# EasyEDA Pro project CALU_BMS_1_2_0_0.epro, schematic Master BMS

## Sheets
1 MAIN: Board Name: Master; Create Date: 2025-09-05; Page Name: MAIN; Project Name: CALU_BMS; Schematic Name: Master BMS; Update Date: 2025-10-01; Company: EasyEDA.com; Page Size: A4; Version: V1.0.0.1
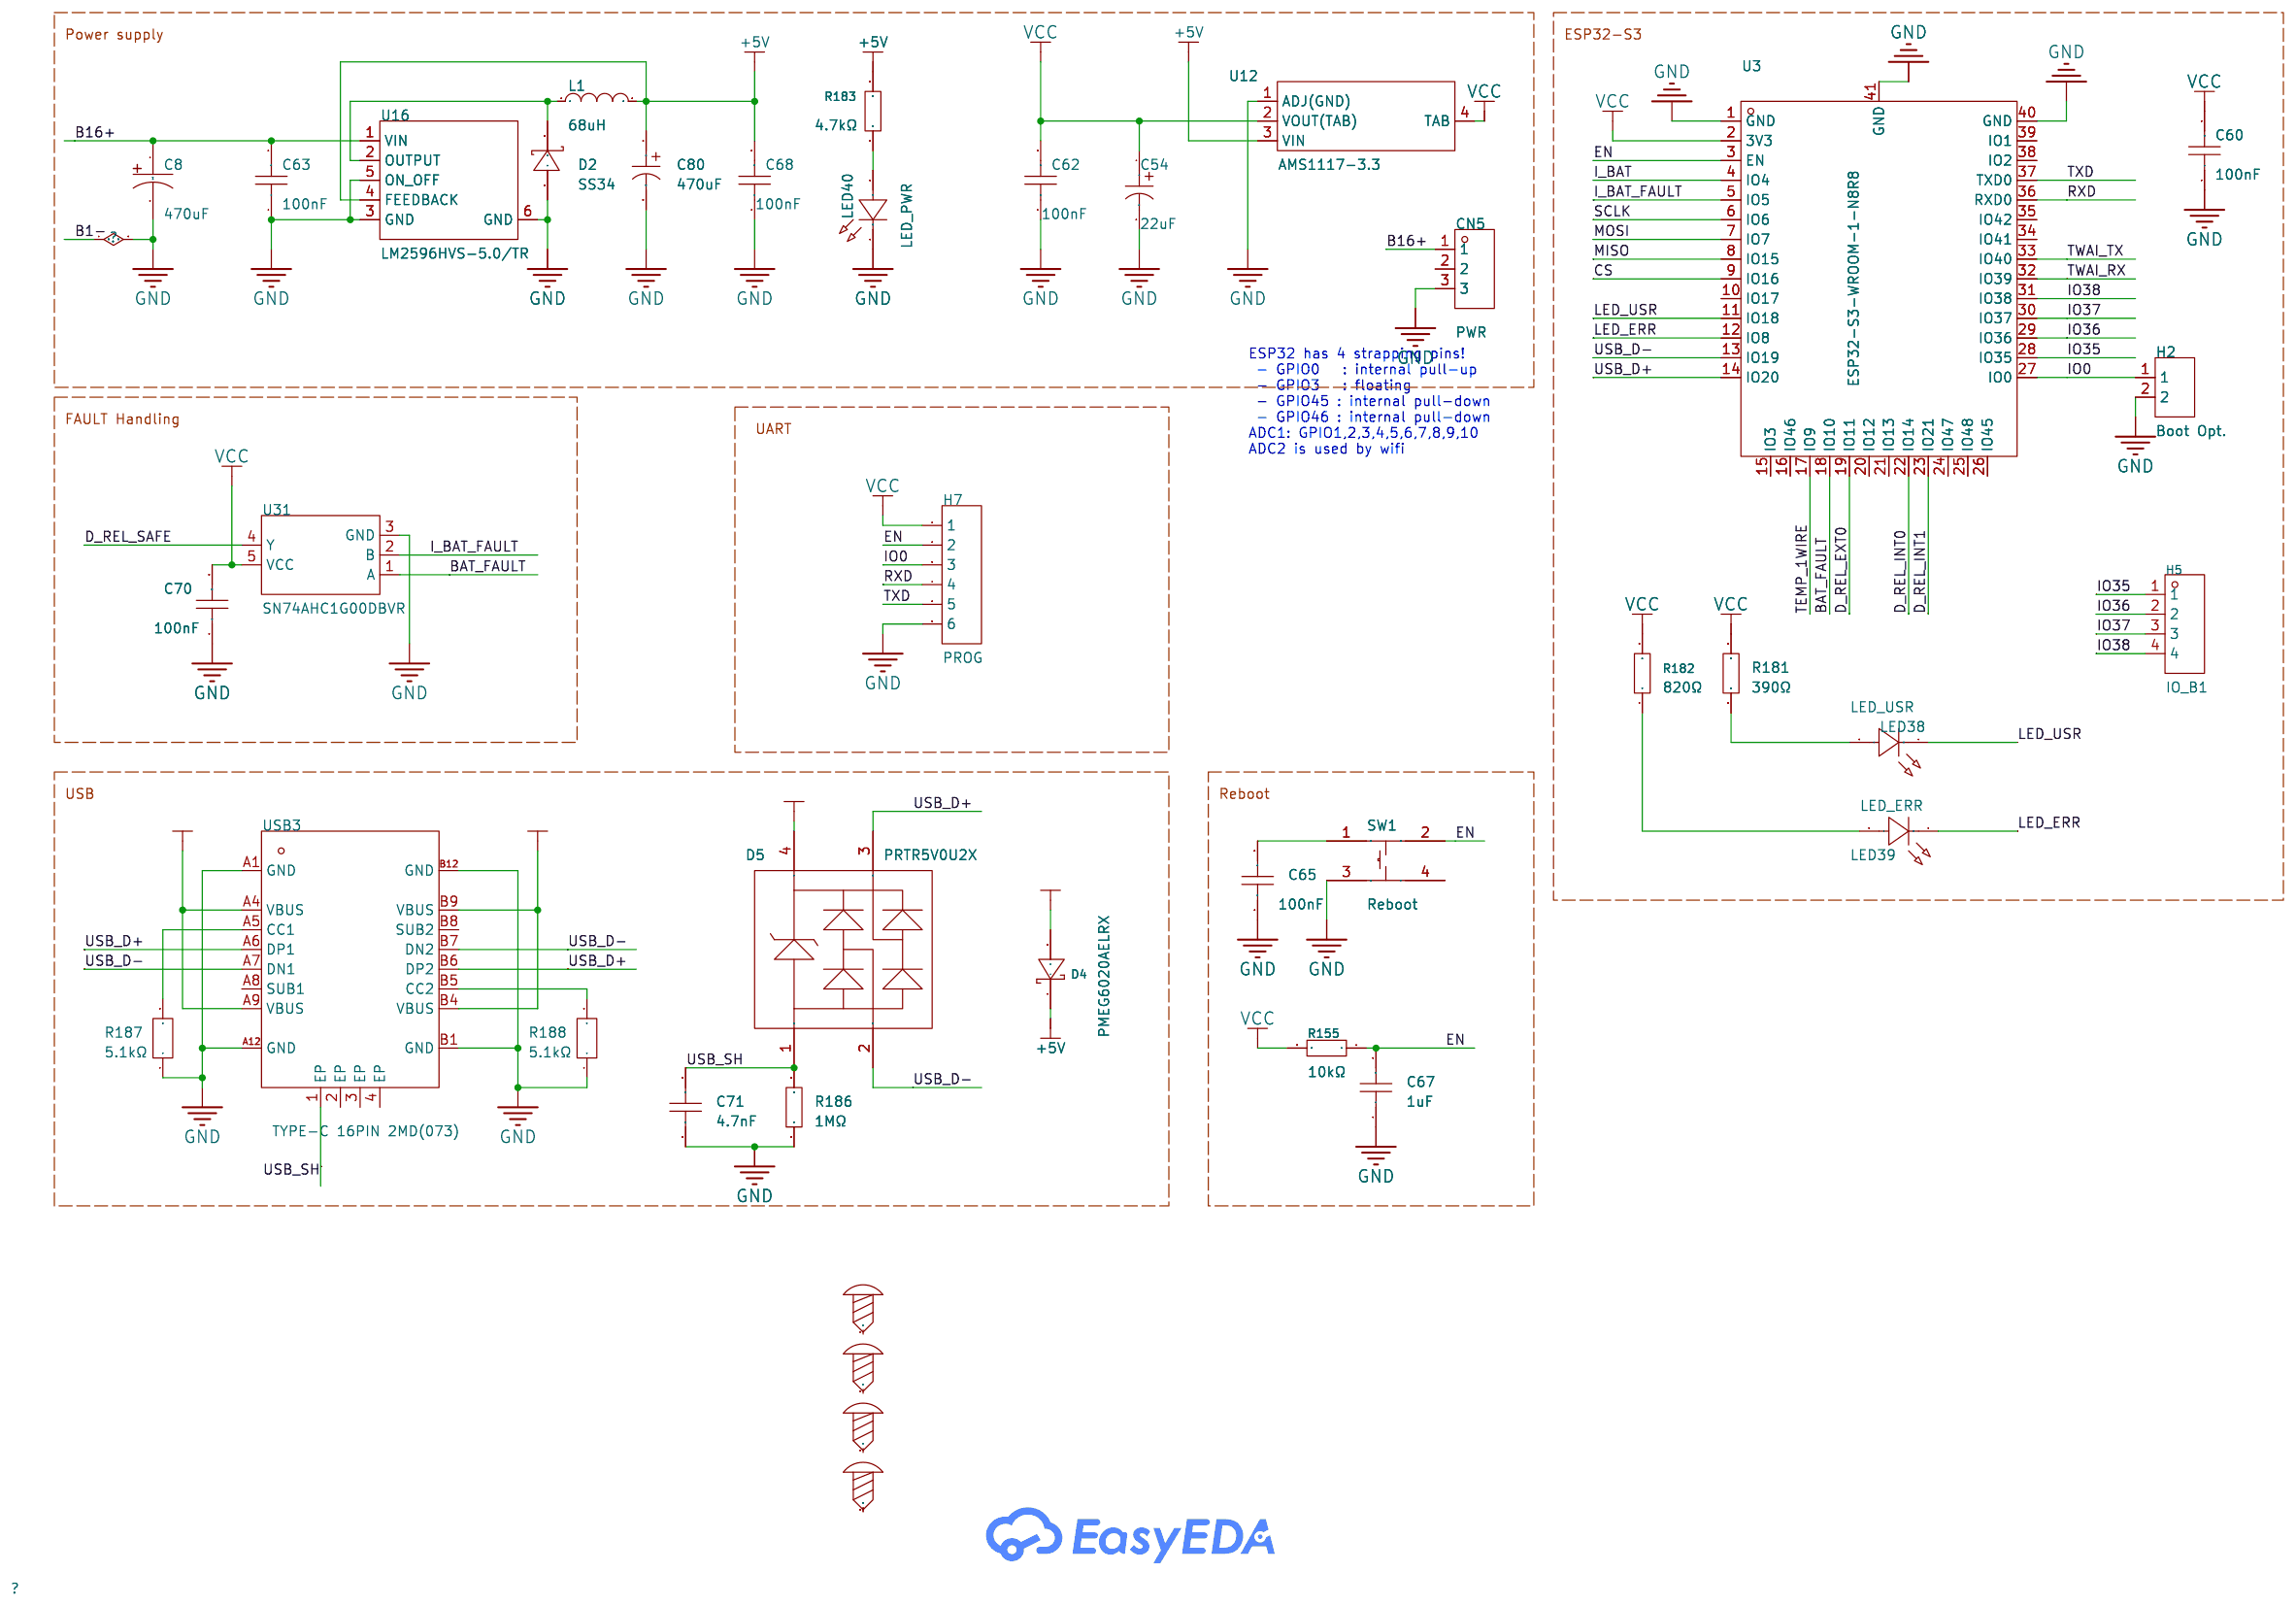
[diagram p6: MAIN]
2 CAN: Create Date: 2025-09-10; Page Name: CAN; Update Date: 2025-09-18; Version: V1.0
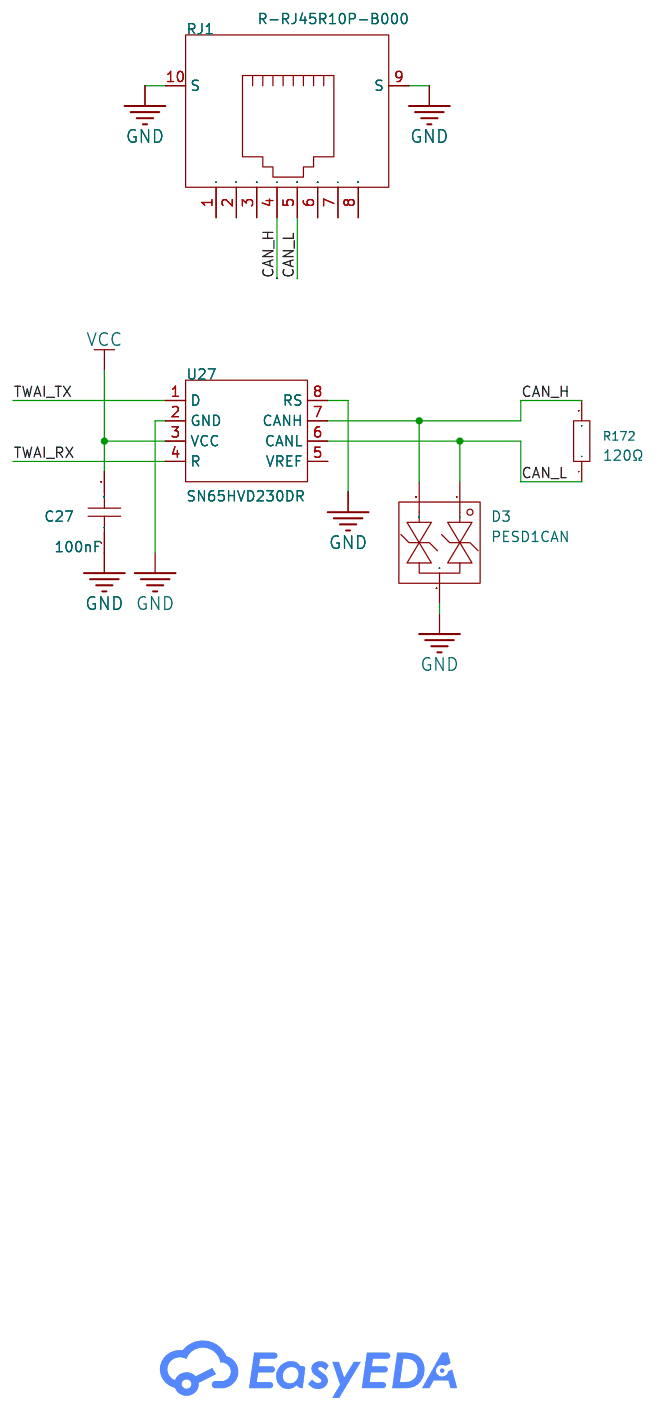
[diagram p7: CAN]
3 RELAY: Create Date: 2025-09-10; Page Name: RELAY; Update Date: 2025-09-18; Version: V1.0
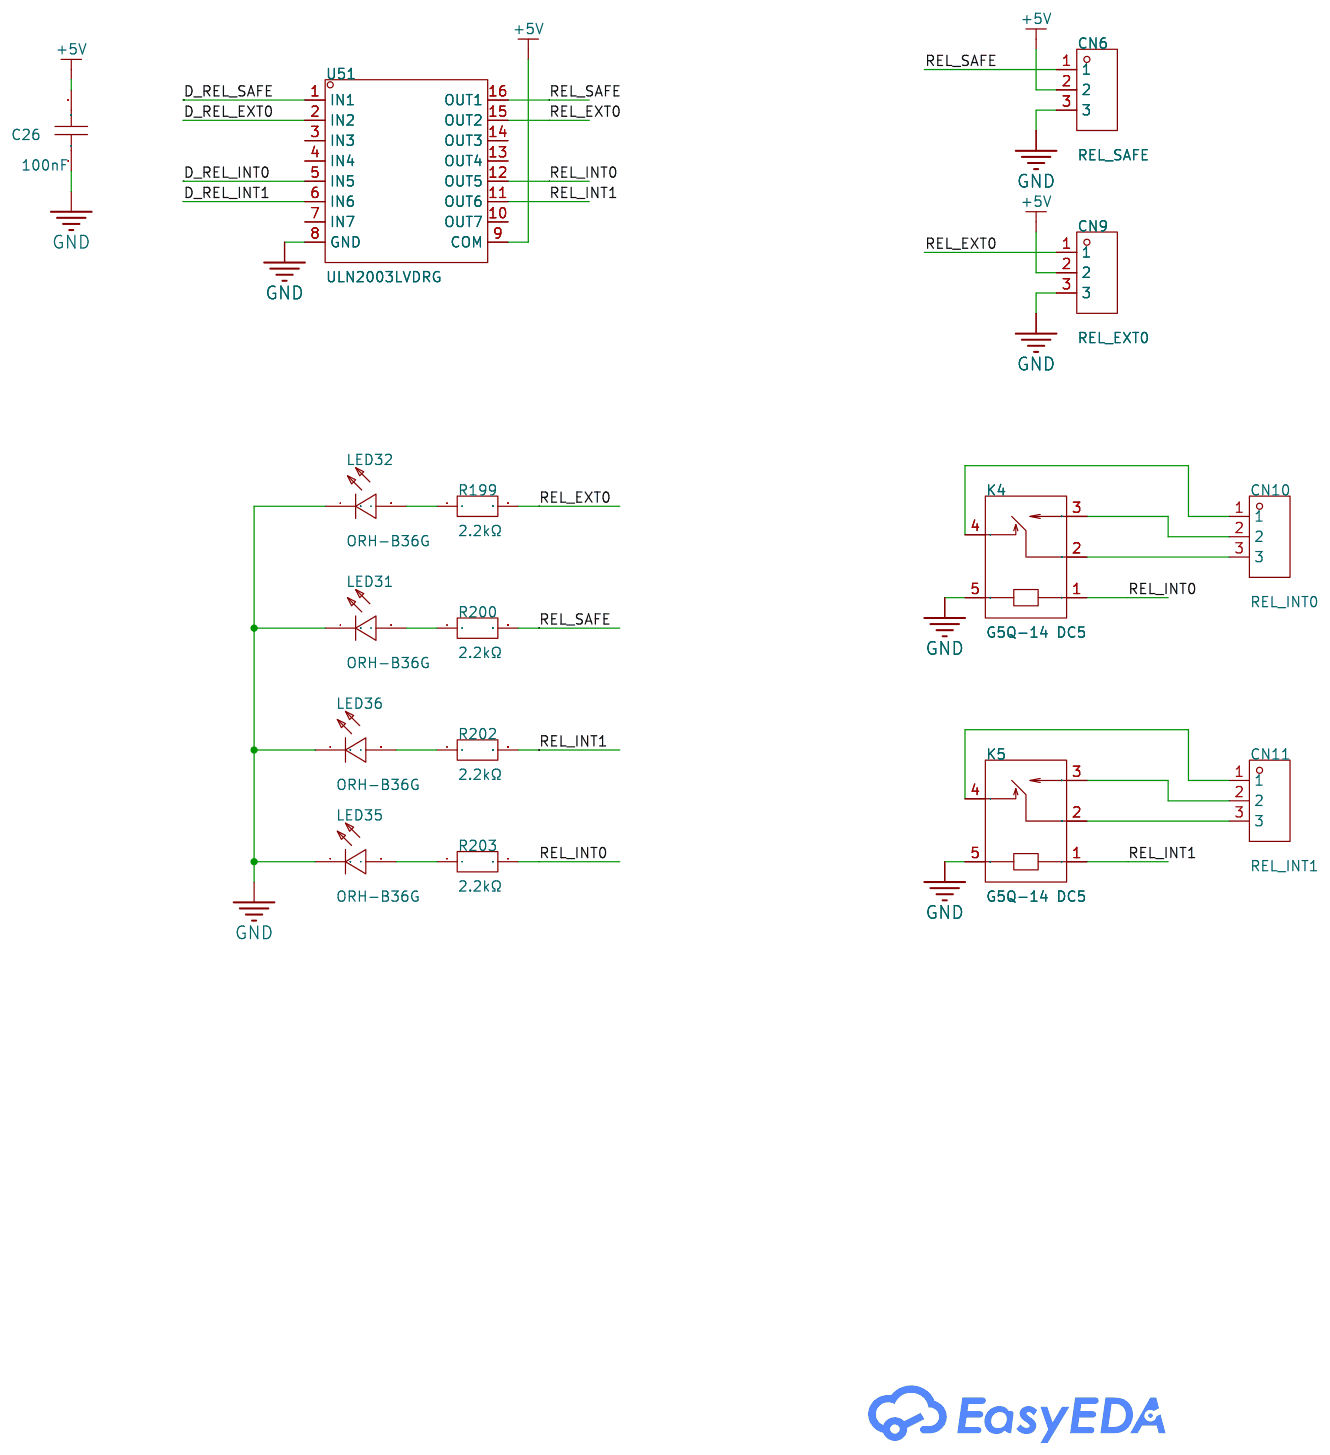
[diagram p8: RELAY]
4 POWER: Create Date: 2025-09-18; Page Name: POWER; Update Date: 2025-09-18; Version: V1.0
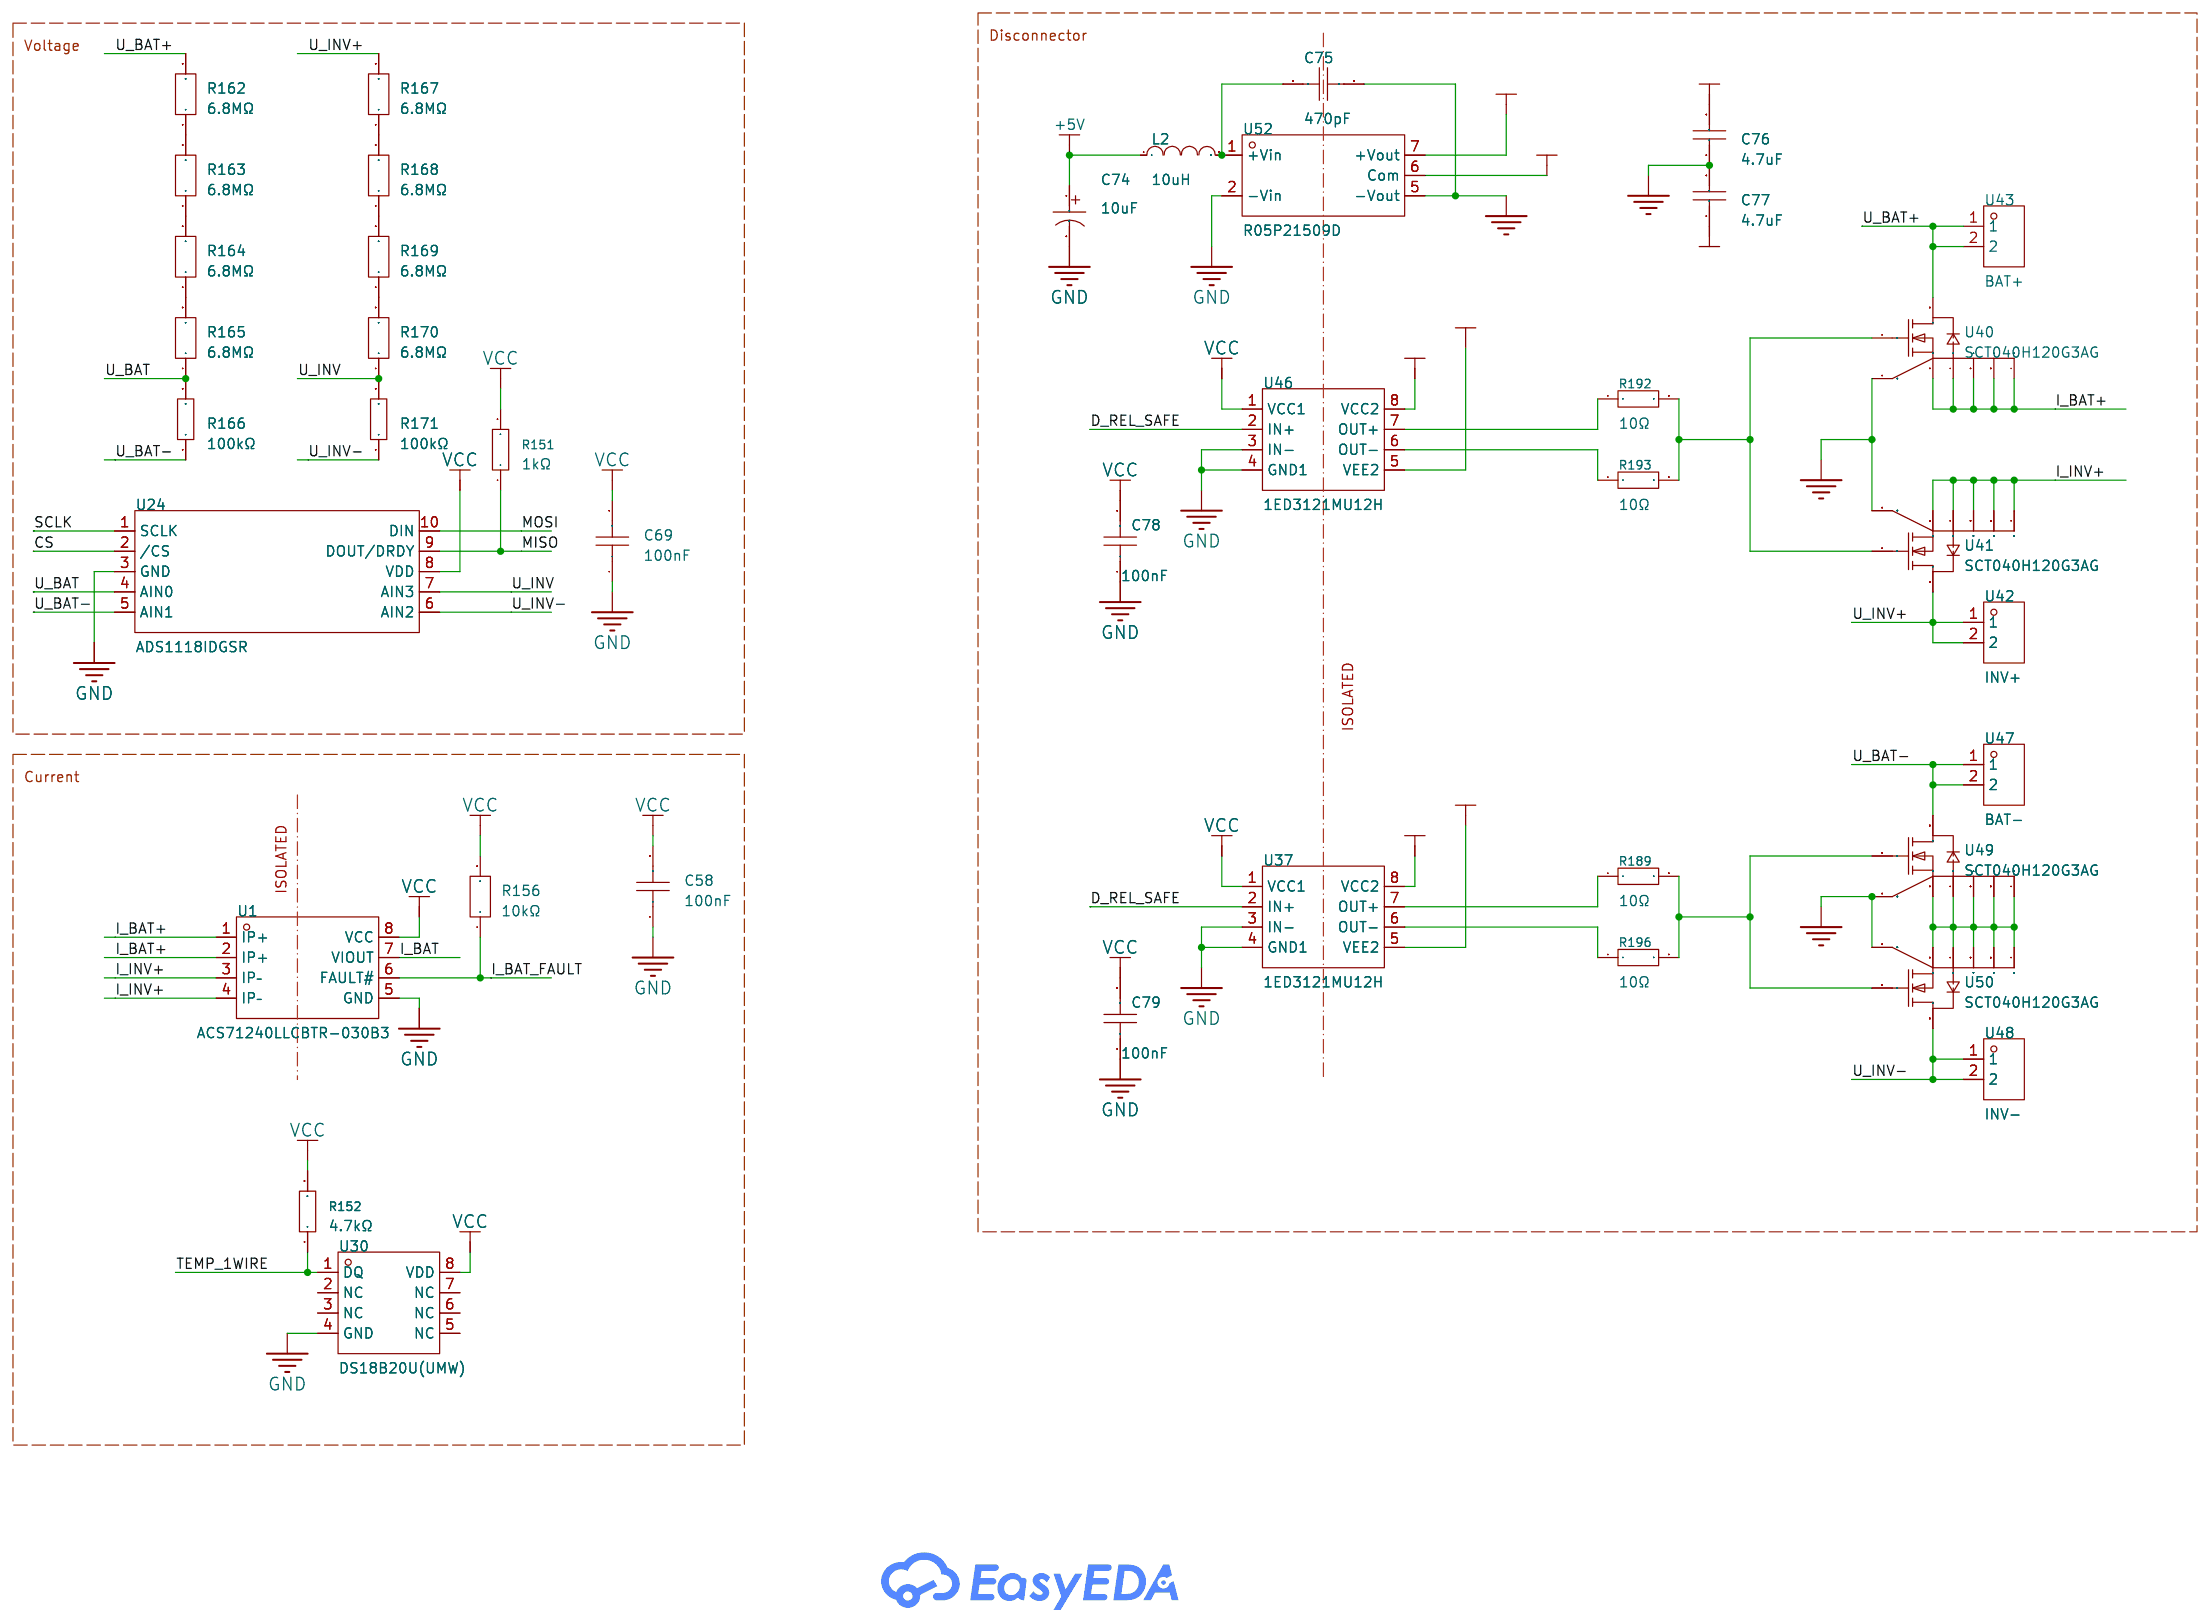
[diagram p9: POWER]

## Parts
sheet CAN
C27  100nF  [C0603]
D3  PESD1CAN  [SOT-23-3_L2.9-W1.3-P1.90-LS2.4-BR]
R172  120Ω  [R0603]
RJ1  R-RJ45R10P-B000  [RJ45-TH_R-RJ45R10P-B000]
U27  SN65HVD230DR  [SOIC-8_L4.9-W3.9-P1.27-LS6.0-BL]
sheet MAIN
C8  470uF  [CAP-SMD_BD16.0-L17.0-W17.0-FD-LS18.0]
C54  22uF  [CAP-SMD_BD5.0-L5.3-W5.3-LS6.0-FD]
C60  100nF  [C0603]
C62  100nF  [C0603]
C63  100nF  [C0603]
C65  100nF  [C0603]
C67  1uF  [C0603]
C68  100nF  [C0603]
C70  100nF  [C0603]
C71  4.7nF  [C0603]
C80  470uF  [CAP-SMD_BD6.3-L6.6-W6.6-LS7.6-RD]
CN5  PWR  [CONN-TH_3P-P3.50_MAX_MX15EDGRM-3.5-GN01-03P-CU-A]
D2  SS34  [SMA_L4.3-W2.6-LS5.2-RD]
D4  PMEG6020AELRX  [SOD-123_L2.6-W1.7-LS3.5-RD]
D5  PRTR5V0U2X  [SOT-143_L2.9-W1.3-P1.92-LS2.3-BL]
H2  Boot Opt.  [HDR-TH_2P-P2.54-V-M]
H5  IO_B1  [HDR-TH_4P-P2.54-V-M]
H7  PROG  [HDR-TH_6P-P2.54-V-M-1]
L1  68uH  [IND-SMD_L12.5-W12.5]
LED38  LED_USR  [LED0603-RD-YELLOW]
LED39  LED_ERR  [LED0603-RD_RED]
LED40  LED_PWR  [LED0603-RD-YELLOW]
R155  10kΩ  [R0603]
R181  390Ω  [R0603]
R182  820Ω  [R0603]
R183  4.7kΩ  [R0603]
R186  1MΩ  [R0603]
R187  5.1kΩ  [R0603]
R188  5.1kΩ  [R0603]
SCREW1  -  [Screw-Hole-M4]
SCREW2  -  [Screw-Hole-M4]
SCREW3  -  [Screw-Hole-M4]
SCREW4  -  [Screw-Hole-M4]
SW1  Reboot  [SW-SMD_4P-L6.0-W6.0-P4.50-LS9.0-H2.5]
U3  ESP32-S3-WROOM-1-N8R8  [WIRELM-SMD_ESP32-S3-WROOM-1]
U12  AMS1117-3.3  [SOT-223-4_L6.5-W3.5-P2.30-LS7.0-BR]
U16  LM2596HVS-5.0/TR  [TO-263-5_L10.2-W8.9-P1.70-LS15.2-BR]
U31  SN74AHC1G00DBVR  [SOT-23-5_L3.0-W1.7-P0.95-LS2.8-BR]
USB3  TYPE-C 16PIN 2MD(073)  [USB-C-SMD_KH-TYPE-C-16P]
sheet POWER
C58  100nF  [C0603]
C69  100nF  [C0603]
C74  10uF  [CAP-SMD_BD4.0-L4.3-W4.3-FD]
C75  470pF  [C1210]
C76  4.7uF  [C1206]
C77  4.7uF  [C1206]
C78  100nF  [C0603]
C79  100nF  [C0603]
L2  10uH  [L0603]
R151  1kΩ  [R0603]
R152  4.7kΩ  [R0603]
R156  10kΩ  [R0603]
R162  6.8MΩ  [R1206]
R163  6.8MΩ  [R1206]
R164  6.8MΩ  [R1206]
R165  6.8MΩ  [R1206]
R166  100kΩ  [R1206]
R167  6.8MΩ  [R1206]
R168  6.8MΩ  [R1206]
R169  6.8MΩ  [R1206]
R170  6.8MΩ  [R1206]
R171  100kΩ  [R1206]
R189  10Ω  [R0603]
R192  10Ω  [R0603]
R193  10Ω  [R0603]
R196  10Ω  [R0603]
U1  ACS71240LLCBTR-030B3  [SOIC-8_L4.9-W3.9-P1.27-LS6.0-BL]
U24  ADS1118IDGSR  [VSSOP-10_L3.0-W3.0-P0.50-LS4.9-BL]
U30  DS18B20U(UMW)  [MSOP-8_L3.0-W3.0-P0.65-LS4.9-BL]
U37  1ED3121MU12H  [PG-DSO-8_L7.5-W6.4-P1.27-LS10.3-BL]
U40  SCT040H120G3AG  [H2PAK-7_L10.4-W10.0-P1.27-LS15.0-BL]
U41  SCT040H120G3AG  [H2PAK-7_L10.4-W10.0-P1.27-LS15.0-BL]
U42  INV+  [CONN-TH_JILN_JL136HT-101601G01]
U43  BAT+  [CONN-TH_JILN_JL136HT-101601G01]
U46  1ED3121MU12H  [PG-DSO-8_L7.5-W6.4-P1.27-LS10.3-BL]
U47  BAT-  [CONN-TH_JILN_JL136HT-101601G01]
U48  INV-  [CONN-TH_JILN_JL136HT-101601G01]
U49  SCT040H120G3AG  [H2PAK-7_L10.4-W10.0-P1.27-LS15.0-BL]
U50  SCT040H120G3AG  [H2PAK-7_L10.4-W10.0-P1.27-LS15.0-BL]
U52  R05P21509D  [PWRM-TH_5P-L19.5-W9.8_YLPTEC_RXXP2XX]
sheet RELAY
C26  100nF  [C0603]
CN6  REL_SAFE  [CONN-TH_3P-P3.50_MAX_MX15EDGRM-3.5-GN01-03P-CU-A]
CN9  REL_EXT0  [CONN-TH_3P-P3.50_MAX_MX15EDGRM-3.5-GN01-03P-CU-A]
CN10  REL_INT0  [CONN-TH_3P-P3.50_MAX_MX15EDGRM-3.5-GN01-03P-CU-A]
CN11  REL_INT1  [CONN-TH_3P-P3.50_MAX_MX15EDGRM-3.5-GN01-03P-CU-A]
K4  G5Q-14 DC5  [RELAY-TH_G5Q-14-DCXX]
K5  G5Q-14 DC5  [RELAY-TH_G5Q-14-DCXX]
LED31  ORH-B36G  [LED0603-RD]
LED32  ORH-B36G  [LED0603-RD]
LED35  ORH-B36G  [LED0603-RD]
LED36  ORH-B36G  [LED0603-RD]
R199  2.2kΩ  [R0603]
R200  2.2kΩ  [R0603]
R202  2.2kΩ  [R0603]
R203  2.2kΩ  [R0603]
U51  ULN2003LVDRG  [SOIC-16_L9.9-W3.9-P1.27-LS6.0-BL]

## Library data of the parts
C26 C27 C58 C60 C62 C63 C65 C68-C70 C78 C79 = CC0603KRX7R9BB104: Capacitance:100nF Tolerance:±10% Tolerance:±10% Voltage Rating:50V Temperature Coefficient:X7R; LCSC Part Name: 100nF ±10% 50V; Supplier Part: C14663; Manufacturer: YAGEO(国巨); Supplier Footprint: 0603; JLCPCB Part Class: Basic Part; Datasheet: https://item.szlcsc.com/datasheet/CC0603KRX7R9BB104/15331.html; Supplier: LCSC; Tolerance: ±10%; Voltage Rating: 50V; Temperature Coefficient: X7R
D3 = PESD1CAN_C20606828: Polarity:Bidirectional Reverse Stand-Off Voltage (Vrwm):24V Clamping Voltage:60V Peak Pulse Current (Ipp):3A@8/20us Peak Pulse Power Dissipation (Ppp):200W@8/20us Voltage - Breakdown:33V Reverse Leakage Current (Ir):1uA level of protection:IEC 61000-4-2 T; Supplier Part: C20606828; Manufacturer: JSMSEMI(杰盛微); Supplier Footprint: SOT-23; JLCPCB Part Class: Extended Part; Datasheet: https://item.szlcsc.com/datasheet/PESD1CAN/21950080.html; Supplier: LCSC; Polarity: Bidirectional; Reverse Stand-Off Voltage (Vrwm): 24V; Clamping Voltage: 60V; Peak Pulse Current (Ipp): 3A@8/20us; Peak Pulse Power Dissipation (Ppp): 200W@8/20us; Voltage - Breakdown: 33V; Reverse Leakage Current (Ir): 1uA; level of protection: IEC 61000-4-2; Type: ESD; Junction Capacitance: 20pF
R172 = 0603WAF1200T5E: Type:Thick Film Resistors Resistance: Tolerance:±1% Tolerance:±1% Power(Watts): Overload Voltage (Max): Temperature Coefficient:±100ppm/℃ Temperature Coefficient:±100ppm/℃ Operating Temperature Range:-55℃~+155℃ Operating Temperature Range:-55℃~+155℃; LCSC Part Name: 120Ω ±1% 100mW 厚膜电阻; Supplier Part: C22787; Manufacturer: UNI-ROYAL(厚声); Supplier Footprint: 0603; JLCPCB Part Class: Basic Part; Datasheet: https://atta.szlcsc.com/upload/public/pdf/source/20200306/C422600_1E6D84923E4A46A82E41ADD87F860B5C.pdf; Supplier: LCSC; Type: Thick Film Resistors; Tolerance: ±1%; Temperature Coefficient: ±100ppm/℃; Operating Temperature Range: -55℃~+155℃
RJ1 = R-RJ45R10P-B000: Connector Type:RJ45 Jack Mounting Type:Right Angle Number of Ports:1 LED:Non-LED Shielding:Shielded Ratings:- Operating Temperature:0℃~+70℃ Operating Temperature:0℃~+70℃; LCSC Part Name: 弯插 不带LED; Supplier Part: C386758; Manufacturer: Ckmtw(灿科盟); Supplier Footprint: 弯插; JLCPCB Part Class: Extended Part; Datasheet: https://item.szlcsc.com/datasheet/R-RJ45R10P-B000/360865.html; Supplier: LCSC; Connector Type: RJ45 Jack; Mounting Type: Right Angle; Number of Ports: 1; LED: Non-LED; Shielding: Shielded; Operating Temperature: 0℃~+70℃
U27 = SN65HVD230DR: Type:CANtransceiver Data Rate:1Mbps Voltage - Supply:- Voltage - Supply:- Current - Supply:- Operating Temperature:-40℃~+85℃ Operating Temperature:-40℃~+85℃; LCSC Part Name: 3.3-V CAN 收发器; Supplier Part: C12084; Manufacturer: TI(德州仪器); Supplier Footprint: SOIC-8; JLCPCB Part Class: Extended Part; Datasheet: https://www.ti.com/cn/lit/gpn/sn65hvd230; Supplier: LCSC; Type: CANtransceiver; Data Rate: 1Mbps; Operating Temperature: -40℃~+85℃
C8 = VZH471M1JTR-1616: Capacitance:470uF Tolerance:±20% Tolerance:±20% Voltage Rating:63V Ripple Current:- Equivalent Series Resistance(ESR):- Diameter:16mm Height - Seated (Max):16.5mm Lifetime:5000hrs@105℃ Operating Temperature:-45℃~+105℃ Operating Temperature:-45℃~+105℃; LCSC Part Name: 470uF ±20% 63V; Supplier Part: C249935; Manufacturer: Lelon(立隆); Supplier Footprint: SMD,D16xL16.5mm; JLCPCB Part Class: Extended Part; Datasheet: https://atta.szlcsc.com/upload/public/pdf/source/20181115/C249956_178B4AAE514BBF17AF6A9453F96D6C96.pdf; Supplier: LCSC; Tolerance: ±20%; Voltage Rating: 63V; Diameter: 16mm; Height - Seated (Max): 16.5mm; Lifetime: 5000hrs@105℃; Operating Temperature: -45℃~+105℃
C54 = CS1E220M-CRD54_C3001207: Capacitance:22uF Tolerance:±20% Tolerance:±20% Voltage Rating:25V Ripple Current:25mA@120Hz Diameter:5mm Height - Seated (Max):5.4mm Lifetime:2000hrs@105℃ Operating Temperature:-40℃~+105℃ Operating Temperature:-40℃~+105℃; LCSC Part Name: 22uF ±20% 25V; Supplier Part: C3001207; Manufacturer: ROQANG(容强); Manufacturer Part: CS1E220M-CRD54; Supplier Footprint: SMD,D5xL5.4mm; JLCPCB Part Class: Extended Part; Datasheet: https://item.szlcsc.com/datasheet/CS1E220M-CRD54/3483887.html; Supplier: LCSC; Tolerance: ±20%; Voltage Rating: 25V; Ripple Current: 25mA@120Hz; Diameter: 5mm; Height - Seated (Max): 5.4mm; Lifetime: 2000hrs@105℃; Operating Temperature: -40℃~+105℃
C67 = CL10A105KB8NNNC: Capacitance:1uF Tolerance:±10% Tolerance:±10% Voltage Rating:50V Temperature Coefficient:X5R; LCSC Part Name: 1uF ±10% 50V; Supplier Part: C15849; Manufacturer: SAMSUNG(三星); Supplier Footprint: 0603; JLCPCB Part Class: Basic Part; Datasheet: https://item.szlcsc.com/datasheet/CL10A105KB8NNNC/16531.html; Supplier: LCSC; Tolerance: ±10%; Voltage Rating: 50V; Temperature Coefficient: X5R
C71 = CAP_0603: Supplier Footprint: 0603
C80 = RVT1C471M0607: Capacitance:470uF Tolerance:±20% Tolerance:±20% Voltage Rating:16V Ripple Current:185mA@120Hz Diameter:6.3mm Height - Seated (Max):7.7mm Lifetime:2000hrs@105℃ Operating Temperature:-40℃~+105℃ Operating Temperature:-40℃~+105℃; LCSC Part Name: 470uF ±20% 16V; Supplier Part: C2977552; Manufacturer: ROQANG(容强); Supplier Footprint: SMD,D6.3xL7.7mm; JLCPCB Part Class: Extended Part; Datasheet: https://item.szlcsc.com/datasheet/RVT1C471M0607/3388608.html; Supplier: LCSC; Tolerance: ±20%; Voltage Rating: 16V; Ripple Current: 185mA@120Hz; Diameter: 6.3mm; Height - Seated (Max): 7.7mm; Lifetime: 2000hrs@105℃; Operating Temperature: -40℃~+105℃
CN5 CN6 CN9 = MX15EDGRM-3.5-03P-GN01-Cu-A: Connector Type:Board Side/Socket - Closed Termination Style:Screw Number of Positions or Pins:1x3P Pitch:3.5mm Color:Green Mounting Type:Right-Angle Pin Number of Pins:3P Number of Rows:1 Number of PINs Per Row:3 Current Rating:8A Voltage Rating (Max):300; LCSC Part Name: 螺丝固定 1x3P 3.5mm 排数:1 每排P数:3; Supplier Part: C5188342; Manufacturer: MAX(迈旭); Supplier Footprint: 弯插,P=3.5mm; JLCPCB Part Class: Extended Part; Datasheet: https://item.szlcsc.com/datasheet/MX15EDGRM-3.5-03P-GN01-Cu-A/5862426.html; Supplier: LCSC; Connector Type: Board Side/Socket - Closed; Termination Style: Screw; Number of Positions or Pins: 1x3P; Pitch: 3.5mm; Color: Green; Mounting Type: Right-Angle Pin; Number of Pins: 3P; Number of Rows: 1; Number of PINs Per Row: 3; Current Rating: 8A; Voltage Rating (Max): 300V; Operating Temperature: -40℃~+105℃
D2 = SS34_C8678: Diode Configuration:Independent Voltage - Forward(Vf@If):550mV@3A Voltage - DC Reverse(Vr):40V Current - Rectified:3A Reverse Leakage Current (Ir):500uA@40V Operating Junction Temperature Range:-55℃~+125℃ Operating Junction Temperature Range:-55℃~+125℃; LCSC Part Name: 电压:40V 电流:3A; Supplier Part: C8678; Manufacturer: MDD(辰达半导体); Supplier Footprint: SMA(DO-214AC); JLCPCB Part Class: Basic Part; Datasheet: https://item.szlcsc.com/datasheet/SS34/9178.html; Supplier: LCSC; Diode Configuration: Independent; Voltage - Forward(Vf@If): 550mV@3A; Voltage - DC Reverse(Vr): 40V; Current - Rectified: 3A; Reverse Leakage Current (Ir): 500uA@40V; Operating Junction Temperature Range: -55℃~+125℃
D4 = PMEG6020AELRX: Forward Voltage (Vf@If):670mV@2A Reverse Voltage (Vr):60V Average Rectified Current (Io):2A Reverse Leakage Current (Ir):700nA@60V; LCSC Part Name: 电压:60V 电流:2A; Supplier Part: C552938; Manufacturer: Nexperia(安世); Supplier Footprint: SOD-123W; JLCPCB Part Class: Extended Part; Datasheet: https://atta.szlcsc.com/upload/public/pdf/source/20200610/C552938_B8C7D9A5A76F9EEA08B29DEA3727CBD6.pdf; Supplier: LCSC; Forward Voltage (Vf@If): 670mV@2A; Reverse Voltage (Vr): 60V; Average Rectified Current (Io): 2A; Reverse Leakage Current (Ir): 700nA@60V
D5 = PRTR5V0U2X_C21713980: Polarity:Unidirectional Reverse Stand-Off Voltage (Vrwm):5V Clamping Voltage:18V Peak Pulse Current (Ipp):4A Peak Pulse Power Dissipation (Ppp):60W Voltage - Breakdown:6V Reverse Leakage Current (Ir):500nA Number of Channels:Dual channel Operating Tempera; LCSC Part Name: 丝印WR1 单向 5V截止 4A峰值脉冲; Supplier Part: C21713980; Manufacturer: GOODWORK(固得沃克); Supplier Footprint: SOT-143; JLCPCB Part Class: Extended Part; Datasheet: https://item.szlcsc.com/datasheet/PRTR5V0U2X/23140173.html; Supplier: LCSC; Polarity: Unidirectional; Reverse Stand-Off Voltage (Vrwm): 5V; Clamping Voltage: 18V; Peak Pulse Current (Ipp): 4A; Peak Pulse Power Dissipation (Ppp): 60W; Voltage - Breakdown: 6V; Reverse Leakage Current (Ir): 500nA; Number of Channels: Dual channel; Operating Temperature: -55℃~+125℃; Type: TVS
H2 = PZ254V-11-02P: Pin Structure:1x2P Pitch:2.54mm Row Spacing:- Circluar Pins/Square Pins:Pin Header Mounting Type:Through Hole Number of Rows:1 Number of Pins:2P Current Rating:- Voltage Rating (Max):- Length of Mating Pin:6mm Insulation Height:2.5mm Length of End Connect; LCSC Part Name: 1x2P 间距:2.54mm 方针 直插; Supplier Part: C492401; Manufacturer: XFCN(兴飞); Supplier Footprint: 插件,P=2.54mm; JLCPCB Part Class: Extended Part; Datasheet: https://item.szlcsc.com/datasheet/PZ254V-11-02P/502957.html; Supplier: LCSC; Pin Structure: 1x2P; Pitch: 2.54mm; Circluar Pins/Square Pins: Pin Header; Mounting Type: Through Hole; Number of Rows: 1; Number of Pins: 2P; Length of Mating Pin: 6mm; Insulation Height: 2.5mm; Length of End Connection Pin: 3mm; Contact Material: Brass; Operating Temperature: -40℃~+105℃; Color: Black
H5 = PZ254V-11-04P: Pin Structure:1x4P Pitch:2.54mm Row Spacing:- Circluar Pins/Square Pins:Pin Header Mounting Type:Through Hole Number of Rows:1 Number of Pins:4P Current Rating:3A Voltage Rating (Max):250V Length of Mating Pin:6mm Insulation Height:2.5mm Length of End Con; LCSC Part Name: 1x4P 间距:2.54mm 方针 直插; Supplier Part: C2691448; Manufacturer: XFCN(兴飞); Supplier Footprint: 插件,P=2.54mm; JLCPCB Part Class: Extended Part; Datasheet: https://item.szlcsc.com/datasheet/PZ254V-11-04P/2801085.html; Supplier: LCSC; Pin Structure: 1x4P; Pitch: 2.54mm; Circluar Pins/Square Pins: Pin Header; Mounting Type: Through Hole; Number of Rows: 1; Number of Pins: 4P; Current Rating: 3A; Voltage Rating (Max): 250V; Length of Mating Pin: 6mm; Insulation Height: 2.5mm; Length of End Connection Pin: 3mm; Operating Temperature: -40℃~+105℃; Color: Black
H7 = 2.54-1x6P直针: Pin Structure:1x6P Pitch:2.54mm Row Spacing:- Circluar Pins/Square Pins:Policy Mounting Type:Straight Number of Rows:Single Row Number of Pins:6P Current Rating:3A Voltage Rating (Max):- Length of Mating Pin:- Insulation Height:- Contact Material:Brass Co; LCSC Part Name: 1x6P 间距:2.54mm 方针 直插; Supplier Part: C37208; Manufacturer: BOOMELE(博穆精密); Supplier Footprint: 插件,P=2.54mm; JLCPCB Part Class: Extended Part; Datasheet: https://atta.szlcsc.com/upload/public/pdf/source/20250115/42A019761A40C8B839643401D8CA5A96.pdf; Supplier: LCSC; Pin Structure: 1x6P; Pitch: 2.54mm; Circluar Pins/Square Pins: Policy; Mounting Type: Straight; Number of Rows: Single Row; Number of Pins: 6P; Current Rating: 3A; Contact Material: Brass; Operating Temperature: -40℃~+105℃; Color: Black
L1 = CYH125-68UH: Inductance: Tolerance:±20% Tolerance:±20% Rated Current: DC Resistance (DCR):64.8mΩ; LCSC Part Name: 68uH ±20%; Supplier Part: C7431083; Manufacturer: SHOU HAN(首韩); Supplier Footprint: SMD,12.5x12.5mm; JLCPCB Part Class: Extended Part; Datasheet: https://atta.szlcsc.com/upload/public/pdf/source/20230621/00B923FD072A2FA4420B8D9BC7718C72.pdf; Supplier: LCSC; Tolerance: ±20%; DC Resistance (DCR): 64.8mΩ
LED38 LED40 = APTD1608LZGCK: Illumination Color:Emerald Green Voltage - Forward(Vf):2.65V Voltage - Forward(Vf):2.65V Power(Watts):102.5mW Forward Current:2mA Wavelength - Dominant:525nm Wavelength - Dominant:525nm Peak Wavelength:515nm Lens Color:Water Clear Luminous Intensity:420mc; Supplier Part: C5569567; Manufacturer: Kingbright; Supplier Footprint: 0603; JLCPCB Part Class: Extended Part; Datasheet: https://item.szlcsc.com/datasheet/APTD1608LZGCK/6487941.html; Supplier: LCSC; Illumination Color: Emerald Green; Voltage - Forward(Vf): 2.65V; Power(Watts): 102.5mW; Forward Current: 2mA; Wavelength - Dominant: 525nm; Peak Wavelength: 515nm; Lens Color: Water Clear; Luminous Intensity: 420mcd; Viewing Angle: 60°; Operating Temperature: -40℃~+85℃
LED39 = APT1608LSECK/J3-PRV: Illumination Color:Red Voltage - Forward(Vf):1.8V Voltage - Forward(Vf):1.8V Power(Watts):84mW Forward Current:2mA Wavelength - Dominant:625nm Wavelength - Dominant:625nm Peak Wavelength:640nm Lens Color:Water Clear Luminous Intensity:100mcd Luminous Inte; Supplier Part: C5357909; Manufacturer: Kingbright; Supplier Footprint: 0603; JLCPCB Part Class: Extended Part; Datasheet: https://item.szlcsc.com/datasheet/APT1608LSECK%252FJ3-PRV/6166552.html; Supplier: LCSC; Illumination Color: Red; Voltage - Forward(Vf): 1.8V; Power(Watts): 84mW; Forward Current: 2mA; Wavelength - Dominant: 625nm; Peak Wavelength: 640nm; Lens Color: Water Clear; Luminous Intensity: 100mcd; Viewing Angle: 120°; Operating Temperature: -40℃~+85℃
R155 = SCR0603J10K: Type:Thick Film Resistors Resistance: Tolerance:±5% Tolerance:±5% Power(Watts): Overload Voltage (Max): Operating Temperature Range:-55℃~+155℃ Operating Temperature Range:-55℃~+155℃; LCSC Part Name: 厚膜电阻 10kΩ ±5% 100mW; Supplier Part: C3017715; Manufacturer: VO(翔胜); Supplier Footprint: 0603; JLCPCB Part Class: Extended Part; Datasheet: https://atta.szlcsc.com/upload/public/pdf/source/20220513/247AF9639BA21CF93567DC289CCC6A22.pdf; Supplier: LCSC; Type: Thick Film Resistors; Tolerance: ±5%; Operating Temperature Range: -55℃~+155℃
R181 = RC0603FR-07390RL: Type:Thick Film Resistors Resistance: Tolerance:±1% Tolerance:±1% Power(Watts): Overload Voltage (Max): Temperature Coefficient:±100ppm/℃ Temperature Coefficient:±100ppm/℃ Operating Temperature Range:-55℃~+155℃ Operating Temperature Range:-55℃~+155℃; LCSC Part Name: 厚膜电阻 390Ω ±1% 100mW; Supplier Part: C114620; Manufacturer: YAGEO(国巨); Supplier Footprint: 0603; JLCPCB Part Class: Extended Part; Datasheet: https://atta.szlcsc.com/upload/public/pdf/source/20180821/C275644_0D56F95EFF785E7D9A1FEF436B37DA78.pdf; Supplier: LCSC; Type: Thick Film Resistors; Tolerance: ±1%; Temperature Coefficient: ±100ppm/℃; Operating Temperature Range: -55℃~+155℃
R182 = 0603WAF8200T5E: Type:Thick Film Resistor Resistance:820Ω Tolerance:±1% Tolerance:±1% Power(Watts):100mW Voltage-Supply(Max):75V Temperature Coefficient:±100ppm/℃ Temperature Coefficient:±100ppm/℃ Operating Temperature:-55℃~+155℃ Operating Temperature:-55℃~+155℃; LCSC Part Name: 820Ω ±1% 100mW 厚膜电阻; Supplier Part: C23253; Manufacturer: UNI-ROYAL(厚声); Supplier Footprint: 0603; JLCPCB Part Class: Basic Part; Datasheet: https://item.szlcsc.com/datasheet/0603WAF8200T5E/23980.html; Supplier: LCSC; Type: Thick Film Resistor; Tolerance: ±1%; Power(Watts): 100mW; Voltage-Supply(Max): 75V; Temperature Coefficient: ±100ppm/℃; Operating Temperature: -55℃~+155℃
R152 R183 = SCR0603J4K7: Type:Thick Film Resistors Resistance: Tolerance:±5% Tolerance:±5% Power(Watts): Overload Voltage (Max): Operating Temperature Range:-55℃~+155℃ Operating Temperature Range:-55℃~+155℃; LCSC Part Name: 厚膜电阻 4.7kΩ ±5% 100mW; Supplier Part: C3017722; Manufacturer: VO(翔胜); Supplier Footprint: 0603; JLCPCB Part Class: Extended Part; Datasheet: https://atta.szlcsc.com/upload/public/pdf/source/20220513/247AF9639BA21CF93567DC289CCC6A22.pdf; Supplier: LCSC; Type: Thick Film Resistors; Tolerance: ±5%; Operating Temperature Range: -55℃~+155℃
R186 = 0603WAF1004T5E: Type:Thick Film Resistors Resistance:1MΩ Tolerance:±1% Tolerance:±1% Power(Watts): Overload Voltage (Max): Temperature Coefficient:±100ppm/℃ Temperature Coefficient:±100ppm/℃ Operating Temperature Range:-55℃~+155℃ Operating Temperature Range:-55℃~+155℃; LCSC Part Name: 1MΩ ±1% 100mW 厚膜电阻; Supplier Part: C22935; Manufacturer: UNI-ROYAL(厚声); Supplier Footprint: 0603; JLCPCB Part Class: Basic Part; Datasheet: https://atta.szlcsc.com/upload/public/pdf/source/20200306/C422600_1E6D84923E4A46A82E41ADD87F860B5C.pdf; Supplier: LCSC; Type: Thick Film Resistors; Tolerance: ±1%; Temperature Coefficient: ±100ppm/℃; Operating Temperature Range: -55℃~+155℃
R187 R188 = FRC0603F5101TS: Type:Thick Film Resistor Resistance:5.1kΩ Tolerance:±1% Tolerance:±1% Power(Watts):100mW Voltage-Supply(Max):75V Temperature Coefficient:±100ppm/℃ Temperature Coefficient:±100ppm/℃ Operating Temperature:-55℃~+155℃ Operating Temperature:-55℃~+155℃; LCSC Part Name: 5.1kΩ ±1% 100mW 厚膜电阻; Supplier Part: C2907044; Manufacturer: FOJAN(富捷); Supplier Footprint: 0603; JLCPCB Part Class: Extended Part; Datasheet: https://item.szlcsc.com/datasheet/FRC0603F5101TS/3180557.html; Supplier: LCSC; Type: Thick Film Resistor; Tolerance: ±1%; Power(Watts): 100mW; Voltage-Supply(Max): 75V; Temperature Coefficient: ±100ppm/℃; Operating Temperature: -55℃~+155℃
SCREW1-SCREW4 = Screw-Hole-M4: Supplier Footprint: 插件; Check: false
SW1 = 1TS005F-2500-5001_C255812: Circuit:SPST Actuator Style:Round Button Operating Force:2.5N Mounting Type:Surface Mount,Vertical Length:6mm Width:6mm Switch Height:5mm with Bracket:Without Bracket Contact Current:50mA Voltage Rating:12V Actuator/Cap Color:Black With Lamp:No Terminatio; LCSC Part Name: 6*6*5mm 立贴 轻触开关; Supplier Part: C255812; Manufacturer: HYP(鸿源精密); Supplier Footprint: SMD-4P,6x6mm; JLCPCB Part Class: Extended Part; Datasheet: https://item.szlcsc.com/datasheet/1TS005F-2500-5001/249855.html; Supplier: LCSC; Circuit: SPST; Actuator Style: Round Button; Operating Force: 2.5N; Mounting Type: Surface Mount,Vertical; Length: 6mm; Width: 6mm; Switch Height: 5mm; with Bracket: Without Bracket; Contact Current: 50mA; Voltage Rating: 12V; Actuator/Cap Color: Black; With Lamp: No; Termination Style: Gull Wing; Life: 70,000 Cycles; Operating Temperature: -40℃~+90℃
U3 = ESP32-S3-WROOM-1-N8R8: Supplier Part: C2913201; Manufacturer: ESPRESSIF(乐鑫); Supplier Footprint: SMD,25.5x18mm; JLCPCB Part Class: Extended Part; Datasheet: https://item.szlcsc.com/datasheet/ESP32-S3-WROOM-1-N8R8/3198299.html; Supplier: LCSC
U12 = AMS1117-3.3_C347222: Output Type:Fixed Voltage - Supply:12V Output Voltage:3.3V Output Voltage:3.3V Output Current:1A Power Supply Rejection Ratio (PSRR):60dB@(120Hz) Voltage Dropout:1.3V@(1A) standby current:- Noise:- Features:Overcurrent Protection Operating Temperature:- O; LCSC Part Name: 输出:3.3V 电流:1A 耐压:12V; Supplier Part: C347222; Manufacturer: UMW(友台半导体); Supplier Footprint: SOT-223; JLCPCB Part Class: Extended Part; Datasheet: https://item.szlcsc.com/datasheet/AMS1117-3.3/323882.html; Supplier: LCSC; Output Type: Fixed; Voltage - Supply: 12V; Output Voltage: 3.3V; Output Current: 1A; Power Supply Rejection Ratio (PSRR): 60dB@(120Hz); Voltage Dropout: 1.3V@(1A); Features: Overcurrent Protection; Output Configuration: Positive electrode; Number of Outputs: 1
U16 = LM2596HVS-5.0/TR: Function:Step-down type Output Type:Fixed Voltage - Supply:5V~60V Voltage - Supply:5V~60V Output Voltage:5V Output Voltage:5V Output Current:3A Frequency - Switching:150kHz Frequency - Switching:150kHz Operating Temperature:-40℃~+125℃ Operating Temperatur; LCSC Part Name: 3A 150KHz DC 开关稳压电路; Supplier Part: C7421039; Manufacturer: HGSEMI(华冠); Supplier Footprint: TO-263-5; JLCPCB Part Class: Extended Part; Datasheet: https://atta.szlcsc.com/upload/public/pdf/source/20230608/50F81A07F1CB4120FC66F79925E72406.pdf; Supplier: LCSC; Function: Step-down type; Output Type: Fixed; Voltage - Supply: 5V~60V; Output Voltage: 5V; Output Current: 3A; Frequency - Switching: 150kHz; Operating Temperature: -40℃~+125℃; Synchronous Rectifier: No; Number of Outputs: 1; Topology: Step-down; Quiescent Current: 3.6mA; Switch tube (built-in/external): Built-in
U31 = SN74AHC1G00DBVR: Logic Type:NAND Gate Number of Channels:1 Voltage - Supply:2V~5.5V Voltage - Supply:2V~5.5V Quiescent Current:1uA Current - Output Low(IOL):8mA Current - Output High(IOH):8mA Input Logic Level - High:1.5V~3.85V Input Logic Level - High:1.5V~3.85V Input Lo; Supplier Part: C350556; Manufacturer: TI(德州仪器); Supplier Footprint: SOT-23-5; JLCPCB Part Class: Extended Part; Datasheet: https://www.ti.com/cn/lit/gpn/sn74ahc1g00; Supplier: LCSC; Logic Type: NAND Gate; Number of Channels: 1; Voltage - Supply: 2V~5.5V; Quiescent Current: 1uA; Current - Output Low(IOL): 8mA; Current - Output High(IOH): 8mA; Input Logic Level - High: 1.5V~3.85V; Input Logic Level - Low: 500mV~1.65V; Series: 74AHC Series; Propagation Delay: 7.5ns@5V,50pF; Operating Temperature: -40℃~+125℃
USB3 = TYPE-C 16PIN 2MD(073): Connector Type:Type-C Protocol Standard:- Gender:Female Mounting Type:Surface Mount, Right Angle Number of Contacts:16P Number of Ports:1 Current Rating-Power:3A Voltage Rating:5V Connect-Disconnect Life:5,000 Cycles Supplementary Features:- Center Height; LCSC Part Name: Type-C 母 卧贴; Supplier Part: C2765186; Manufacturer: SHOU HAN(首韩); Supplier Footprint: SMD; JLCPCB Part Class: Extended Part; Datasheet: https://item.szlcsc.com/datasheet/TYPE-C%252016PIN%25202MD(073)/2901843.html; Supplier: LCSC; Connector Type: Type-C; Gender: Female; Mounting Type: Surface Mount, Right Angle; Number of Contacts: 16P; Number of Ports: 1; Current Rating-Power: 3A; Voltage Rating: 5V; Connect-Disconnect Life: 5,000 Cycles; Detection color: Black; Operating Temperature: -25℃~+85℃
C74 = RVT1V100M0405_C72485: Capacitance:10uF Tolerance:±20% Tolerance:±20% Voltage Rating:35V Ripple Current:15mA@120Hz Equivalent Series Resistance(ESR):- Diameter:4mm Height - Seated (Max):5.4mm Lifetime:2000hrs@105℃ Operating Temperature:-40℃~+105℃ Operating Temperature:-40℃~+105; LCSC Part Name: 10uF ±20% 35V; Supplier Part: C72485; Manufacturer: ROQANG(容强); Manufacturer Part: RVT1V100M0405; Supplier Footprint: SMD,D4xL5.4mm; JLCPCB Part Class: Extended Part; Datasheet: https://item.szlcsc.com/datasheet/RVT1V100M0405/73596.html; Supplier: LCSC; Tolerance: ±20%; Voltage Rating: 35V; Ripple Current: 15mA@120Hz; Diameter: 4mm; Height - Seated (Max): 5.4mm; Lifetime: 2000hrs@105℃; Operating Temperature: -40℃~+105℃
C75 = FV32X471K202EEG: Capacitance:470pF Tolerance:±10% Tolerance:±10% Voltage Rating:2kV Temperature Coefficient:X7R; LCSC Part Name: 470pF ±10% 2kV; Supplier Part: C146199; Manufacturer: PSA(信昌电陶); Supplier Footprint: 1210; JLCPCB Part Class: Extended Part; Datasheet: https://item.szlcsc.com/datasheet/FV32X471K202EEG/157531.html; Supplier: LCSC; Tolerance: ±10%; Voltage Rating: 2kV; Temperature Coefficient: X7R
C76 C77 = CL31B475KBHNNNE: Capacitance:4.7uF Tolerance:±10% Tolerance:±10% Voltage Rating:50V Temperature Coefficient:X7R; LCSC Part Name: 4.7uF ±10% 50V; Supplier Part: C51205; Manufacturer: SAMSUNG(三星); Supplier Footprint: 1206; JLCPCB Part Class: Extended Part; Datasheet: https://item.szlcsc.com/datasheet/CL31B475KBHNNNE/52218.html; Supplier: LCSC; Tolerance: ±10%; Voltage Rating: 50V; Temperature Coefficient: X7R
L2 = LQM18FN100M00D: Inductance:10uH Tolerance:±20% Tolerance:±20% Current Rating:50mA Current - Saturation (Isat):50mA DC Resistance(DCR):1.17Ω Q @ Frequency:- Frequency - Self Resonant:30MHz Ratings:-; LCSC Part Name: 10uH ±20% 50mA 停产; Supplier Part: C86083; Manufacturer: muRata(村田); Supplier Footprint: 0603; JLCPCB Part Class: Extended Part; Datasheet: https://item.szlcsc.com/datasheet/LQM18FN100M00D/87259.html; Supplier: LCSC; Tolerance: ±20%; Current Rating: 50mA; Current - Saturation (Isat): 50mA; DC Resistance(DCR): 1.17Ω; Frequency - Self Resonant: 30MHz
R151 = SCR0603F1K: Type:Thick Film Resistors Resistance: Tolerance:±1% Tolerance:±1% Power(Watts): Overload Voltage (Max): Operating Temperature Range:-55℃~+155℃ Operating Temperature Range:-55℃~+155℃; LCSC Part Name: 厚膜电阻 1kΩ ±1% 100mW; Supplier Part: C3016283; Manufacturer: VO(翔胜); Supplier Footprint: 0603; JLCPCB Part Class: Extended Part; Datasheet: https://atta.szlcsc.com/upload/public/pdf/source/20220513/247AF9639BA21CF93567DC289CCC6A22.pdf; Supplier: LCSC; Type: Thick Film Resistors; Tolerance: ±1%; Operating Temperature Range: -55℃~+155℃
R156 = FRC0603J103 TS: Type:Thick Film Resistor Resistance:10kΩ Tolerance:±5% Tolerance:±5% Power(Watts):100mW Voltage-Supply(Max):75V Temperature Coefficient:±100ppm/℃ Temperature Coefficient:±100ppm/℃ Operating Temperature:-55℃~+155℃ Operating Temperature:-55℃~+155℃; LCSC Part Name: 10kΩ ±5% 100mW 厚膜电阻; Supplier Part: C2930027; Manufacturer: FOJAN(富捷); Supplier Footprint: 0603; JLCPCB Part Class: Extended Part; Supplier: LCSC; Type: Thick Film Resistor; Tolerance: ±5%; Power(Watts): 100mW; Voltage-Supply(Max): 75V; Temperature Coefficient: ±100ppm/℃; Operating Temperature: -55℃~+155℃
R162-R165 R167-R170 = FRC1206F6804TS: Type:Thick Film Resistors Resistance:6.8MΩ Tolerance:±1% Tolerance:±1% Power(Watts): Overload Voltage (Max): Temperature Coefficient:±100ppm/℃ Temperature Coefficient:±100ppm/℃; LCSC Part Name: 6.8MΩ ±1% 250mW 厚膜电阻; Supplier Part: C3000532; Manufacturer: FOJAN(富捷); Supplier Footprint: 1206; JLCPCB Part Class: Extended Part; Datasheet: https://atta.szlcsc.com/upload/public/pdf/source/20211221/925EC7D7225764EE0046F22065062C87.pdf; Supplier: LCSC; Type: Thick Film Resistors; Tolerance: ±1%; Temperature Coefficient: ±100ppm/℃
R166 R171 = 1206W4F1003T5E: Type:Thick Film Resistors Resistance:100kΩ Tolerance:±1% Tolerance:±1% Power(Watts): Overload Voltage (Max): Temperature Coefficient:±100ppm/℃ Temperature Coefficient:±100ppm/℃ Operating Temperature Range:-55℃~+155℃ Operating Temperature Range:-55℃~+155℃; LCSC Part Name: 100kΩ ±1% 250mW 厚膜电阻; Supplier Part: C17900; Manufacturer: UNI-ROYAL(厚声); Supplier Footprint: 1206; JLCPCB Part Class: Basic Part; Datasheet: https://atta.szlcsc.com/upload/public/pdf/source/20200306/C422600_1E6D84923E4A46A82E41ADD87F860B5C.pdf; Supplier: LCSC; Type: Thick Film Resistors; Tolerance: ±1%; Temperature Coefficient: ±100ppm/℃; Operating Temperature Range: -55℃~+155℃
R189 R192 R193 R196 = 0603WAF100JT5E: Type:Thick Film Resistor Resistance:10Ω Tolerance:±1% Tolerance:±1% Power(Watts):100mW Voltage-Supply(Max):75V Temperature Coefficient:±400ppm/℃ Temperature Coefficient:±400ppm/℃ Operating Temperature:-55℃~+155℃ Operating Temperature:-55℃~+155℃; LCSC Part Name: 10Ω ±1% 100mW 厚膜电阻; Supplier Part: C22859; Manufacturer: UNI-ROYAL(厚声); Supplier Footprint: 0603; JLCPCB Part Class: Basic Part; Datasheet: https://item.szlcsc.com/datasheet/0603WAF100JT5E/23586.html; Supplier: LCSC; Type: Thick Film Resistor; Tolerance: ±1%; Power(Watts): 100mW; Voltage-Supply(Max): 75V; Temperature Coefficient: ±400ppm/℃; Operating Temperature: -55℃~+155℃
U1 = ACS71240LLCBTR-030B3: Current Range:30A Current Range:30A Supply Voltage:3V~3.6V Supply Voltage:3V~3.6V Sensitivity:44mV/A Operating Temperature:-40℃~+150℃ Operating Temperature:-40℃~+150℃; LCSC Part Name: 汽车级、电磁隔离电流传感器IC，具有共模场抑制和过流检测功能，采用小尺寸低轮廓封装; Supplier Part: C2654896; Manufacturer: ALLEGRO(美国埃戈罗); Supplier Footprint: SOIC-8; JLCPCB Part Class: Extended Part; Datasheet: https://atta.szlcsc.com/upload/public/pdf/source/20210504/4B0CDD79DB0F509936A244CF43CA4D3A.pdf; Supplier: LCSC; Current Range: 30A; Supply Voltage: 3V~3.6V; Sensitivity: 44mV/A; Operating Temperature: -40℃~+150℃
U24 = ADS1118IDGSR_C55347: Resolution(Bits):16 Sampling Rate:860Hz number of channels:2 Voltage - Supply:2V~5.5V Voltage - Supply:2V~5.5V Interface:SPI differential input:Yes Integral non - linearity:2LSB Integral non - linearity:2LSB Operating Temperature:-40℃~+125℃ Operating Temp; LCSC Part Name: 兼容SPI的16位模数转换器; Supplier Part: C55347; Manufacturer: TI(德州仪器); Supplier Footprint: VSSOP-10-0.5mm; JLCPCB Part Class: Extended Part; Datasheet: https://www.ti.com/cn/lit/gpn/ads1118; Supplier: LCSC; Resolution(Bits): 16; Sampling Rate: 860Hz; number of channels: 2; Voltage - Supply: 2V~5.5V; Interface: SPI; differential input: Yes; Integral non - linearity: 2LSB; Operating Temperature: -40℃~+125℃; Clock/Oscillator: Built-In; Clock Frequency: 1MHz; Voltage Reference: Built-In; Programmable Gain: Support; Temperature Sensors: Built-In; ADC architecture: Sigma-Delta; Data rate: 128Hz；8Hz；64Hz；16Hz；32Hz；250Hz；475Hz；860Hz; Supply Current (Iq): 150uA; Full-Scale Range(FSR): 2.048V
U30 = DS18B20U(UMW): Temperature range:-55℃~+125℃ Temperature range:-55℃~+125℃ Resolution:±0.4℃ Resolution:±0.4℃ Supply Voltage:2.5V~5.5V Supply Voltage:2.5V~5.5V Standby Current:750nA Interface Type:Single Bus; LCSC Part Name: 温度传感器; Supplier Part: C695836; Manufacturer: UMW(友台半导体); Supplier Footprint: MSOP-8; JLCPCB Part Class: Extended Part; Datasheet: https://atta.szlcsc.com/upload/public/pdf/source/20241210/329D6A12FB6ADF2EBB286F6D44242ED4.pdf; Supplier: LCSC; Temperature range: -55℃~+125℃; Resolution: ±0.4℃; Supply Voltage: 2.5V~5.5V; Standby Current: 750nA; Interface Type: Single Bus
U37 U46 = 1ED3121MU12H: Driven Configuration:Half-Bridge Load Type:IGBT；MOSFET；SiC MOSFET Number of Drivers:1 Current - Output Low(IOL):5.5A Current - Output High(IOH):5.5A Voltage - Supply:10V~35V Voltage - Supply:10V~35V Fall Time:15ns Propagation Delay tpLH:90ns Propagation D; Supplier Part: C530922; Manufacturer: Infineon(英飞凌); Supplier Footprint: DSO-8; JLCPCB Part Class: Extended Part; Datasheet: https://item.szlcsc.com/datasheet/1ED3121MU12H/553430.html; Supplier: LCSC; Driven Configuration: Half-Bridge; Load Type: IGBT；MOSFET；SiC MOSFET; Number of Drivers: 1; Current - Output Low(IOL): 5.5A; Current - Output High(IOH): 5.5A; Voltage - Supply: 10V~35V; Fall Time: 15ns; Propagation Delay tpLH: 90ns; Propagation Delay tpHL: 90ns; Features: Under Voltage Protection；Short Circuit Protection; Operating Temperature: -40℃~+125℃
U40 U41 U49 U50 = SCT040H120G3AG: Drain to Source Voltage:1.2kV Current - Continuous Drain(Id):40A Pd - Power Dissipation:300W Gate Threshold Voltage (Vgs(th)):4.2V Gate Charge(Qg):54nC Ciss-Input Capacitance:1.329nF Reverse Transfer Capacitance (Crss):10pF Operating Temperature:-55℃~+175; Supplier Part: C28224958; Manufacturer: ST(意法半导体); Supplier Footprint: H2PAK-7; JLCPCB Part Class: Extended Part; Datasheet: https://item.szlcsc.com/datasheet/SCT040H120G3AG/29963518.html; Supplier: LCSC; Drain to Source Voltage: 1.2kV; Current - Continuous Drain(Id): 40A; Pd - Power Dissipation: 300W; Gate Threshold Voltage (Vgs(th)): 4.2V; Gate Charge(Qg): 54nC; Ciss-Input Capacitance: 1.329nF; Reverse Transfer Capacitance (Crss): 10pF; Operating Temperature: -55℃~+175℃; Output Capacitance(Coss): 78pF; RDS(on): 54mΩ
U42 U43 U47 U48 = JL136HT-101601G01: Structure:1x1P Pitch:10.16mm Color:Green Mounting Style:Direct Insert Number of Pins:1P Number of Rows:1 Number of PINs Per Row:1 Screw Specification:M4 Current Rating (Max):65A Voltage Rating (Max):1kV Wire Gauge - AWG:6~20 Wire Gauge - AWG:6~20 Wire Gau; LCSC Part Name: 1x1P 10.16mm 直插 排数:1 每排P数:1; Supplier Part: C2908420; Manufacturer: JILN(锦凌); Supplier Footprint: 插件,P=10.16mm; JLCPCB Part Class: Extended Part; Datasheet: https://atta.szlcsc.com/upload/public/pdf/source/20211026/C480E0167F9E46BFD3461AA68F751918.pdf; Supplier: LCSC; Structure: 1x1P; Pitch: 10.16mm; Color: Green; Mounting Style: Direct Insert; Number of Pins: 1P; Number of Rows: 1; Number of PINs Per Row: 1; Screw Specification: M4; Current Rating (Max): 65A; Voltage Rating (Max): 1kV; Wire Gauge - AWG: 6~20; Wire Gauge - mm2: 2.5~16; Operating Temperature Range: -40℃~+105℃
U52 = R05P21509D: Number of Channels:2 Output Power:2W Voltage - Supply:5V Voltage - Supply:5V Conversion Efficiency:90% Conversion Efficiency:90% Output Voltage:-9V；+15V Output Voltage:-9V；+15V Output Current(Max):+67mA；-111mA Output Current(Max):+67mA；-111mA Capacitive L; LCSC Part Name: DC/DC模块电源，SiC和IGBT驱动器专用; Supplier Part: C18212304; Manufacturer: YLPTEC(易川); Supplier Footprint: SIP,19.5x9.8mm; JLCPCB Part Class: Extended Part; Datasheet: https://item.szlcsc.com/datasheet/R05P21509D/19382644.html; Supplier: LCSC; Number of Channels: 2; Output Power: 2W; Voltage - Supply: 5V; Conversion Efficiency: 90%; Output Voltage: -9V；+15V; Output Current(Max): +67mA；-111mA; Capacitive Load(Max): 330uF; Isolation Voltage(Vrms): 3kV; Features: Short Circuit Protection; Operating Temperature: -40℃~+105℃
CN10 CN11 = MX15EDGRM-3.5-03P-GN01-Cu-A: Connector Type:Board Side/Socket - Closed Termination Style:Screw Number of Positions or Pins:1x3P Pitch:3.5mm Color:Green Mounting Type:Right-Angle Pin Number of Pins:3P Number of Rows:1 Number of PINs Per Row:3 Current Rating:8A Voltage Rating (Max):300; LCSC Part Name: 螺丝固定 1x3P 3.5mm 排数:1 每排P数:3; Supplier Part: C5188342; Manufacturer: MAX(迈旭); Manufacturer Part: REL_EXT0; Supplier Footprint: 弯插,P=3.5mm; JLCPCB Part Class: Extended Part; Datasheet: https://item.szlcsc.com/datasheet/MX15EDGRM-3.5-03P-GN01-Cu-A/5862426.html; Supplier: LCSC; Connector Type: Board Side/Socket - Closed; Termination Style: Screw; Number of Positions or Pins: 1x3P; Pitch: 3.5mm; Color: Green; Mounting Type: Right-Angle Pin; Number of Pins: 3P; Number of Rows: 1; Number of PINs Per Row: 3; Current Rating: 8A; Voltage Rating (Max): 300V; Operating Temperature: -40℃~+105℃
K4 K5 = G5Q-14 DC5: Coil Voltage:5V Contact Form:One Conversion: 1C (SPDT-Conversion) Pin Number:5 Contact Rating:5A@30VDC；10A@250VAC Maximum Switching Voltage:277V@AC；30V@DC Coil Rated Power:400mW Contact Material:Silver Alloy (Cadmium-Free) Maximum Switching Current:10A Co; Supplier Part: C397241; Manufacturer: OMRON(欧姆龙); Supplier Footprint: 插件,10x20mm; JLCPCB Part Class: Extended Part; Datasheet: https://atta.szlcsc.com/upload/public/pdf/source/20221128/484119CAADE1EC17AE95C78452500B8B.pdf; Supplier: LCSC; Coil Voltage: 5V; Contact Form: One Conversion: 1C (SPDT-Conversion); Pin Number: 5; Contact Rating: 5A@30VDC；10A@250VAC; Maximum Switching Voltage: 277V@AC；30V@DC; Coil Rated Power: 400mW; Contact Material: Silver Alloy (Cadmium-Free); Maximum Switching Current: 10A; Coil Type: Non-polar - Single Coil; Coil Resistance: 63Ω; Contact Resistance: 100mΩ; Operate Time: 10ms; Release Time: 5ms; Operating Temperature: -40℃~+105℃
LED31 LED32 LED35 LED36 = ORH-B36G: Emitted Color:Blue Forward Voltage (VF):2.6V~3.1V Forward Voltage (VF):2.6V~3.1V Power Dissipation:100mW Forward Current:2mA Dominant Wavelength:458nm~475nm Dominant Wavelength:458nm~475nm Peak Wavelength:460nm Diode Configuration:- Lens Color:Colorless t; Supplier Part: C193191; Manufacturer: Orient(奥伦德); Supplier Footprint: 0603; JLCPCB Part Class: Extended Part; Datasheet: https://atta.szlcsc.com/upload/public/pdf/source/20180629/C193191_B3945EB375B4464C1EA8B70EB4C9D3B5.pdf; Supplier: LCSC; Emitted Color: Blue; Forward Voltage (VF): 2.6V~3.1V; Power Dissipation: 100mW; Forward Current: 2mA; Dominant Wavelength: 458nm~475nm; Peak Wavelength: 460nm; Lens Color: Colorless transparent lens; Luminous Intensity: 23mcd~53mcd; Viewing Angle: 130°; Operating Temperature: -40℃~+85℃
R199 R200 R202 R203 = FRC0603J222 TS: Type:Thick Film Resistor Resistance:2.2kΩ Tolerance:±5% Tolerance:±5% Power(Watts):100mW Voltage-Supply(Max):75V Temperature Coefficient:±100ppm/℃ Temperature Coefficient:±100ppm/℃ Operating Temperature:-55℃~+155℃ Operating Temperature:-55℃~+155℃; LCSC Part Name: 2.2kΩ ±5% 100mW 厚膜电阻; Supplier Part: C2907117; Manufacturer: FOJAN(富捷); Supplier Footprint: 0603; JLCPCB Part Class: Extended Part; Supplier: LCSC; Type: Thick Film Resistor; Tolerance: ±5%; Power(Watts): 100mW; Voltage-Supply(Max): 75V; Temperature Coefficient: ±100ppm/℃; Operating Temperature: -55℃~+155℃
U51 = ULN2003LVDRG: Supplier Part: C19723745; Manufacturer: HGC(深圳汉芯); Supplier Footprint: SOP-16; JLCPCB Part Class: Extended Part; Datasheet: https://atta.szlcsc.com/upload/public/pdf/source/20231229/510CB63C529524B7D9B301B6D0087BD8.pdf; Supplier: LCSC

## Nets
+5V: C26.2 C68.2 C74.1 C80.1 CN6.2 CN9.2 D4.1(-) L1.2 L2.1 R183.2 U12.3(VIN) U16.4(FEEDBACK) U51.9(COM)
+15V_ISO: C76.2 U37.8(VCC2) U46.8(VCC2) U52.7(+Vout)
-9V_ISO: C77.1 U37.5(VEE2) U46.5(VEE2) U52.6(Com)
GND: C8.2 C26.1 C27.1 C54.2 C58.1 C60.1 C62.1 C63.1 C65.1 C67.1 C68.1 C69.1 C70.1 C71.2 C74.2 C78.1 C79.1 C80.2 CN5.3 CN6.3 CN9.3 D2.2(A) D3.3 H2.2 H7.6 K4.5 K5.5 LED31.1(C) LED32.1(C) LED35.1(C) LED36.1(C) LED40.1(C) R186.1 R187.1 R188.1 RJ1.9(S) RJ1.10(S) SW1.3 U1.5(GND) U3.1(GND) U3.40(GND) U3.41(GND) U12.1(ADJ(GND)) U16.3(GND) U16.5(ON_OFF) U16.6(GND) U24.3(GND) U27.2(GND) U27.8(RS) U30.4(GND) U31.3(GND) U37.3(IN-) U37.4(GND1) U46.3(IN-) U46.4(GND1) U51.8(GND) U52.2(-Vin) USB3.A1(GND) USB3.A12(GND) USB3.B1(GND) USB3.B12(GND)
GND_ISO: C75.2 C76.1 C77.2 U40.2(DS) U41.2(DS) U49.2(DS) U50.2(DS) U52.5(-Vout)
VBUS: D4.2(+) D5.4 USB3.A4(VBUS) USB3.A9(VBUS) USB3.B4(VBUS) USB3.B9(VBUS)
VCC: C27.2 C54.1 C58.2 C60.2 C62.2 C69.2 C70.2 C78.2 C79.2 H7.1 R151.2 R152.2 R155.2 R156.2 R181.2 R182.2 U1.8(VCC) U3.2(3V3) U12.2(VOUT(TAB)) U12.4(TAB) U24.8(VDD) U27.3(VCC) U30.8(VDD) U31.5(VCC) U37.1(VCC1) U46.1(VCC1)
B16+: C8.1 C63.2 CN5.1 U16.1(VIN)
BAT_FAULT: U3.18(IO10) U31.1(A)
CAN_H: D3.2 R172.2 RJ1.4 U27.7(CANH)
CAN_L: D3.1 R172.1 RJ1.5 U27.6(CANL)
CS: U3.9(IO16) U24.2(/CS)
D_REL_EXT0: U3.19(IO11) U51.2(IN2)
D_REL_INT0: U3.22(IO14) U51.5(IN5)
D_REL_INT1: U3.23(IO21) U51.6(IN6)
D_REL_SAFE: U31.4(Y) U37.2(IN+) U46.2(IN+) U51.1(IN1)
EN: C67.2 H7.2 R155.1 SW1.2 U3.3(EN)
I_BAT: U1.7(VIOUT) U3.4(IO4)
I_BAT+: U1.1(IP+) U1.2(IP+) U40.3(S) U40.4(S) U40.5(S) U40.6(S) U40.7(S)
I_BAT_FAULT: R156.1 U1.6(FAULT#) U3.5(IO5) U31.2(B)
I_INV+: U1.3(IP–) U1.4(IP–) U41.3(S) U41.4(S) U41.5(S) U41.6(S) U41.7(S)
IO0: H2.1 H7.3 U3.27(IO0)
IO35: H5.1 U3.28(IO35)
IO36: H5.2 U3.29(IO36)
IO37: H5.3 U3.30(IO37)
IO38: H5.4 U3.31(IO38)
LED_ERR: LED39.1(K) U3.12(IO8)
LED_USR: LED38.1(C) U3.11(IO18)
MISO: R151.1 U3.8(IO15) U24.9(DOUT/DRDY)
MOSI: U3.7(IO7) U24.10(DIN)
REL_EXT0: CN9.1 R199.2 U51.15(OUT2)
REL_INT0: K4.1 R203.2 U51.12(OUT5)
REL_INT1: K5.1 R202.2 U51.11(OUT6)
REL_SAFE: CN6.1 R200.2 U51.16(OUT1)
RXD: H7.4 U3.36(RXD0)
SCLK: U3.6(IO6) U24.1(SCLK)
TEMP_1WIRE: R152.1 U3.17(IO9) U30.1(DQ)
TWAI_RX: U3.32(IO39) U27.4(R)
TWAI_TX: U3.33(IO40) U27.1(D)
TXD: H7.5 U3.37(TXD0)
U_BAT: R165.1 R166.2 U24.4(AIN0)
U_BAT+: R162.2 U40.8(D) U43.1 U43.2
U_BAT-: R166.1 U24.5(AIN1) U47.1 U47.2 U49.8(D)
U_INV: R170.1 R171.2 U24.7(AIN3)
U_INV+: R167.2 U41.8(D) U42.1 U42.2
U_INV-: R171.1 U24.6(AIN2) U48.1 U48.2 U50.8(D)
USB_D+: D5.3 U3.14(IO20) USB3.A6(DP1) USB3.B6(DP2)
USB_D-: D5.2 U3.13(IO19) USB3.A7(DN1) USB3.B7(DN2)
USB_SH: C71.1 D5.1 R186.2 USB3.1(EP)
$1N1884: LED38.2(A) R181.1
$1N1887: LED39.2(A) R182.1
$1N6610: D2.1(K) L1.1 U16.2(OUTPUT)
$1N6618: LED40.2(A) R183.1
$1N10532: C65.2 SW1.1
$1N15059: R187.2 USB3.A5(CC1)
$1N15060: R188.2 USB3.B5(CC2)
$3N427: CN10.3 K4.2
$3N431: CN10.2 K4.3
$3N449: CN11.3 K5.2
$3N454: CN11.2 K5.3
$3N461: CN11.1 K5.4
$3N6646: CN10.1 K4.4
$3N6968: LED32.2(A) R199.1
$3N6972: LED31.2(A) R200.1
$3N6980: LED36.2(A) R202.1
$3N6984: LED35.2(A) R203.1
$5N1329: R189.1 U37.7(OUT+)
$5N1330: R196.1 U37.6(OUT-)
$5N1331: R189.2 R196.2 U49.1(G) U50.1(G)
$5N1337: C75.1 L2.2 U52.1(+Vin)
$5N1350: R192.1 U46.7(OUT+)
$5N1351: R193.1 U46.6(OUT-)
$5N1352: R192.2 R193.2 U40.1(G) U41.1(G)
$5N1360: U49.3(S) U49.4(S) U49.5(S) U49.6(S) U49.7(S) U50.3(S) U50.4(S) U50.5(S) U50.6(S) U50.7(S)
$5N2438: R162.1 R163.2
$5N2439: R163.1 R164.2
$5N2440: R164.1 R165.2
$5N2447: R167.1 R168.2
$5N2448: R168.1 R169.2
$5N2449: R169.1 R170.2

Not connected (* = marked no-connect by the designer): CN5 2; RJ1 1 2 3 6 7 8; SCREW1 1; SCREW2 1; SCREW3 1; SCREW4 1; SW1 4; U3 10(IO17) 15(IO3) 16(IO46) 20(IO12) 21(IO13) 24(IO47) 25(IO48) 26(IO45) 34(IO41) 35(IO42) 38(IO2) 39(IO1); U27 5(VREF); U30 2(NC) 3(NC) 5(NC) 6(NC) 7(NC); U51 3(IN3) 4(IN4) 7(IN7) 10(OUT7) 13(OUT4) 14(OUT3); USB3 2(EP) 3(EP) 4(EP) A8(SUB1) B8(SUB2)

## Notes on the sheets
sheet 1
- Power supply
- ESP32-S3
- FAULT Handling
- UART
- ESP32 has 4 strapping pins!
   - GPIO0   : internal pull-up
   - GPIO3   : floating
   - GPIO45 : internal pull-down
   - GPIO46 : internal pull-down
  ADC1: GPIO1,2,3,4,5,6,7,8,9,10
  ADC2 is used by wifi
- USB
- Reboot
sheet 4
- Disconnector
- Voltage
- ISOLATED
- Current
- ISOLATED
